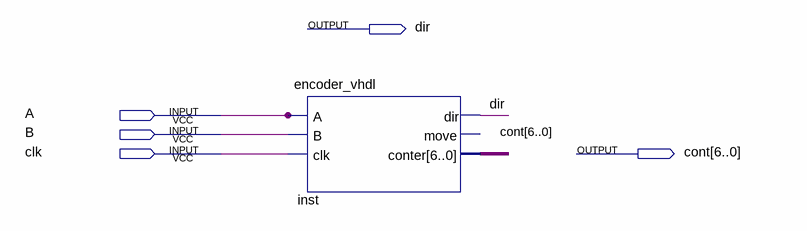
[diagram p0: schematic sheet]
// Quartus schematic trabalho.bdf as structural Verilog: 1 symbols, 5 pins
module trabalho (
  input  A,
  input  B,
  input  clk,
  output dir,
  output [6:0] cont
);

  encoder_vhdl inst (.A(A), .B(B), .clk(clk), .dir(dir), .conter(cont));  // open: move
endmodule
